# Altium project SD Card Breakout with USB.PrjPcb
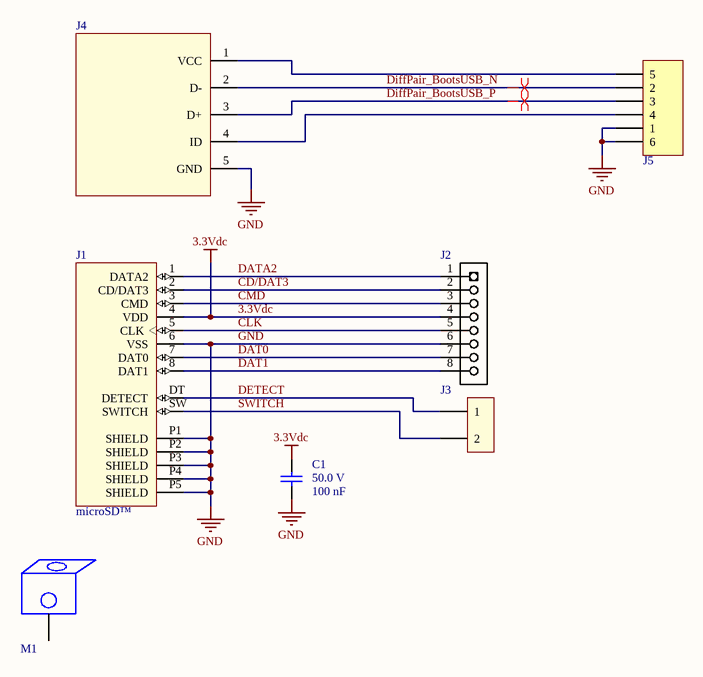
[diagram p0: SD Card Breakout with USB.SchDoc]
1 sheet, 7 parts. Net scope: global (net labels, ports and power ports of the same name join across sheets).

## Sheet SD Card Breakout with USB.SchDoc
size A

### Parts
C1  Voltage Rating (DC): 50.0 V  Capacitance: 100 nF  [Cap,0805]  (hidden comment: Cap)
J1  Card Type: microSD™  [Conn,SD micro,503182-1852]  (hidden comment: 5031821852)
J2  HEADER,0.1",8Pin,SinlgeRow  [Header,8Pin,SingleRow, RA,0.1"]  (value not drawn)
J3  Generic Header  [HEADER-1X2,0.1",RA1]  (value not drawn)
J4  USB3090-30-A  [Conn,USB micro,AB, Receptacle,USB3090-30-A]  (value not drawn)
J5  Header, through hole,vertical, 6pin,1 Row,0.1", M20-9991245  [Header, 6 pin, 0.1" Spaceing - RA]  (value not drawn)
M1  4334  [Mech,Bracket,RA,#6,Threaded]  (value not drawn)

### Nets
3.3Vdc: C1.2 J1.4(VDD) J2.4
GND: C1.1 J1.6(VSS) J1.P1(SHIELD) J1.P2(SHIELD) J1.P3(SHIELD) J1.P4(SHIELD) J1.P5(SHIELD) J2.6 J4.5(GND) J4.6(Shield) J4.7(Shield) J4.8(Shield) J4.9(Shield) J5.1 J5.6
CD/DAT3: J1.2(CD/DAT3) J2.2
CLK: J1.5(CLK) J2.5
CMD: J1.3(CMD) J2.3
DAT0: J1.7(DAT0) J2.7
DAT1: J1.8(DAT1) J2.8
DATA2: J1.1(DATA2) J2.1
DETECT: J1.DT(DETECT) J3.1
DiffPair_BootsUSB_N: J4.2(D-) J5.2
DiffPair_BootsUSB_P: J4.3(D+) J5.3
SWITCH: J1.SW(SWITCH) J3.2
NetJ4_1: J4.1(VCC) J5.5
NetJ4_4: J4.4(ID) J5.4

Not connected (* = marked no-connect by the designer): M1 1

### Layout directives
differential pair; net class USBDiff: DiffPair_BootsUSB_N, DiffPair_BootsUSB_P

### Library data of the parts
C1 = Cap,0805,100nf,50V,5%,08055C104JAT2A: Capacitor; Ceramic; Cap 0.1 uF; Tol 5%; Vol-Rtg 50 VDC; SMT; 0805; X7R; Tape & Reel; Lead-Free Status: Lead Free; Case/Package (SI): 2012; Insulation Resistance: 100 GΩ; Detailed Description: 0.1µF ±5% 50V Ceramic Capacitor X7R 0805 (2012 Metric); Mounting Style: Surface Mount; Packaging: Tape & Reel (TR), Cut Tape (CT); RoHS: Compliant; Size-Width: 1.24 mm; Case/Package: 0805; Number of Pins: 2; digikey url: http://www.digikey.ca/product-detail/en/avx-corporation/08055C104JAT2A/478-3352-1-ND/930144; REACH SVHC Compliance: No SVHC; Dielectric Characteristic: X7R; Capacitance Tolerance: ±5%; Size-Length: 2.01 mm; Size-Height: 710 µm; Size-Thickness: 940 µm; Manufacturer Part Number: 08055C104JAT2A; Octopart URL: http://octopart.com/08055c104jat2a-avx-55388010; Operating Temperature: -55°C ~ 125°C
J1 = Conn,SD Micro,10 (8 + 2) Position,SMD,RA,5031821852: MICRO SD NORMAL ULTRALOWPRO8CKTE; Manufacturer: Molex; Detailed Description: 10 (8 + 2) Position Card Connector microSD™ Surface Mount, Right Angle Gold; Categories: Connectors, Interconnects   Memory Connectors - PC Card Sockets; Connector Type: Connector and Ejector; Insertion, Removal Method: Push In, Push Out; mfg P/N: 5031821852; Series: 503182; Part Status: Active; Number of Positions: 10 (8 + 2); Mounting Type: Surface Mount, Right Angle; Features: Switch; Height Above Board: 0.057" (1.45mm); Mounting Feature: Normal, Standard - Top; Contact Finish: Gold
J3 = Header 1x2,0.1"Spacing
J4 = Conn,SMD,USB Micro AB,Recept,USB 2.0,  USB3090-30-A: MICRO A/B SKT,BOTTOM-SMT, R/A, 3; Manufacturer: GCT; Detailed Description: USB - micro AB USB 2.0 Receptacle Connector 5 Position Surface Mount, Right Angle; Through Hole; Connector Type: USB - micro AB; Number of Contacts: 5; Gender: Receptacle; Specifications: USB 2.0; Number of Ports: 1; Current Rating (Amps): 1A, 1.8A; Voltage - Rated: 30VAC; Mating Cycles: 10000; Shielding: Shielded; Material Flammability Rating: UL94 V-0; Categories: Connectors, Interconnects   USB, DVI, HDMI Connectors; mfg P/N: USB3090-30-A; Series: USB3090; Part Status: Active; Mounting Type: Surface Mount, Right Angle; Through Hole; Mounting Feature: Bottom Mount, Horizontal; Termination: Solder; Features: Solder Retention; Operating Temperature: -30°C ~ 85°C; Contact Finish: Gold; Shell/Shielding Material: Steel, Stainless (SUS); Insulation Color: Black
J5 = Header, through hole,vertical, 6pin,1 Row,0.1", M20-9991245: 2.54mm (0.1") Pitch SIL Vertical PC Tail Pin Header, 6.1mm mating pin height, gold (hi-temp mould), 6 contacts; Manufacturer Part Number: M20-9990645; Number of Contacts: 6; Gender: Male; Number of Mating Cycles: 300; Insulation Resistance: 10.0 GΩ; Voltage Rating (AC): 750 V; Contact Resistance: 15.0 mΩ; Current Rating: 3.00 A; REACH SVHC Compliance: No SVHC; Insulation Material: Polyester; Contact Material: Phosphor Bronze; RoHS: Compliant; Mounting Style: Through Hole, Vertical; Pin Pitch: 2.54 mm; Supplier 1: Digi-Key
M1 = Mech,Bracket,RA,Threaded,4334: Mounting Bracket Short L #6-32 (2) Steel, Nickel Plated; Manufacturer: Keystone Electronics; Thread/Screw/Hole: Size #6-32 (2); mfg P/N: 4334; Type: Bracket, Threaded Hole(s); Material: Steel, Nickel Plated
J2 = HEADER,0.1",8Pin,SinlgeRow: Supplier 1: Digi-Key; Supplier Part Number 1: S1011E-36-ND